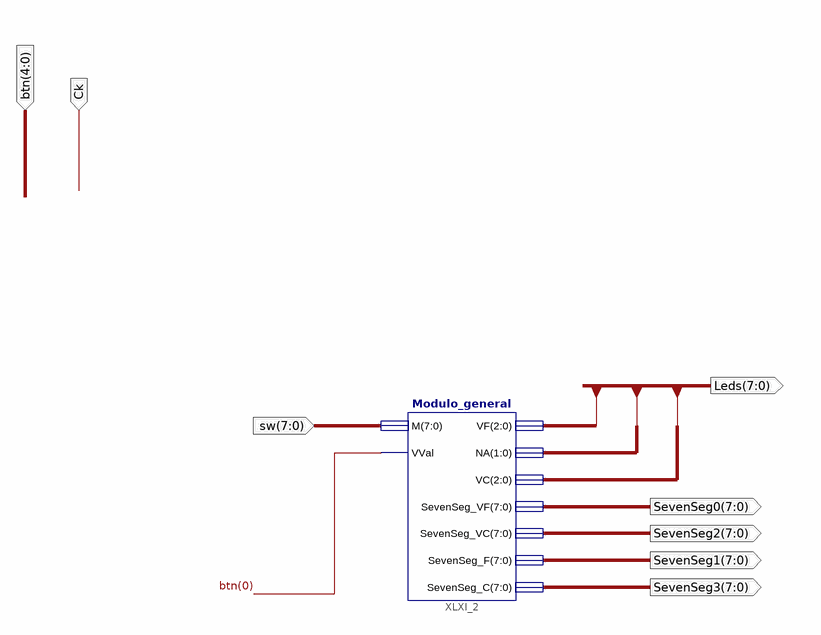
[diagram p0: schematic sheet 1]
// Xilinx ISE schematic MyDesign.sch (spartan6) as structural Verilog: 1 symbols, 8 ports
module MyDesign (
  input  [7:0] sw,
  input  [4:0] btn,
  input  Ck,
  output [7:0] SevenSeg1,
  output [7:0] SevenSeg2,
  output [7:0] SevenSeg3,
  output [7:0] SevenSeg0,
  output [7:0] Leds
);

  Modulo_general XLXI_2 (
    .M(sw), .NA(Leds[4:3]), .SevenSeg_C(SevenSeg3), .SevenSeg_F(SevenSeg1), .SevenSeg_VC(SevenSeg2),
    .SevenSeg_VF(SevenSeg0), .VC(Leds[2:0]), .VF(Leds[7:5]), .VVal(btn[0]));
endmodule
